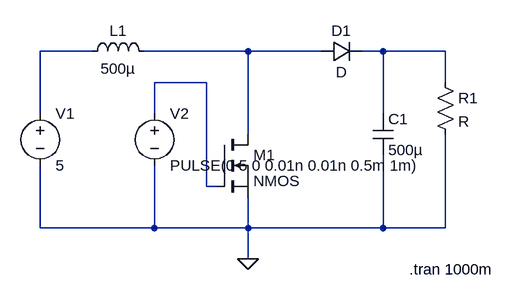
[diagram p0: schematic BoosterCircuit.asc]
BoosterCircuit.asc, the LTspice schematic file:
Version 4
SHEET 1 880 680
WIRE 160 48 80 48
WIRE 400 48 240 48
WIRE 512 48 400 48
WIRE 608 48 576 48
WIRE 704 48 608 48
WIRE 336 96 256 96
WIRE 704 96 704 48
WIRE 80 144 80 48
WIRE 256 144 256 96
WIRE 608 144 608 48
WIRE 400 176 400 48
WIRE 336 256 336 96
WIRE 352 256 336 256
WIRE 80 320 80 224
WIRE 256 320 256 224
WIRE 256 320 80 320
WIRE 400 320 400 272
WIRE 400 320 256 320
WIRE 608 320 608 208
WIRE 608 320 400 320
WIRE 704 320 704 176
WIRE 704 320 608 320
WIRE 400 368 400 320
FLAG 400 368 0
SYMBOL voltage 80 128 R0
WINDOW 123 0 0 Left 0
WINDOW 39 0 0 Left 0
SYMATTR InstName V1
SYMATTR Value 5
SYMBOL voltage 256 128 R0
WINDOW 123 0 0 Left 0
WINDOW 39 0 0 Left 0
SYMATTR InstName V2
SYMATTR Value PULSE(0 5 0 0.01n 0.01n 0.5m 1m)
SYMBOL nmos 352 176 R0
SYMATTR InstName M1
SYMBOL ind 144 64 R270
WINDOW 0 32 56 VTop 2
WINDOW 3 5 56 VBottom 2
SYMATTR InstName L1
SYMATTR Value 500µ
SYMBOL diode 512 64 R270
WINDOW 0 32 32 VTop 2
WINDOW 3 0 32 VBottom 2
SYMATTR InstName D1
SYMBOL cap 592 144 R0
SYMATTR InstName C1
SYMATTR Value 500µ
SYMBOL res 688 80 R0
SYMATTR InstName R1
TEXT 648 384 Left 2 !.tran 1000m

The netlist it stands for:
* BoosterCircuit.asc
V1 N001 0 5
V2 N004 0 PULSE(0 5 0 0.01n 0.01n 0.5m 1m)
M1 N002 N004 0 0 NMOS
L1 N001 N002 500µ
D1 N002 N003 D
C1 N003 0 500µ
R1 N003 0 R
.model D D
.lib standard.dio
.model NMOS NMOS
.model PMOS PMOS
.lib standard.mos
.tran 1000m
.backanno
.end